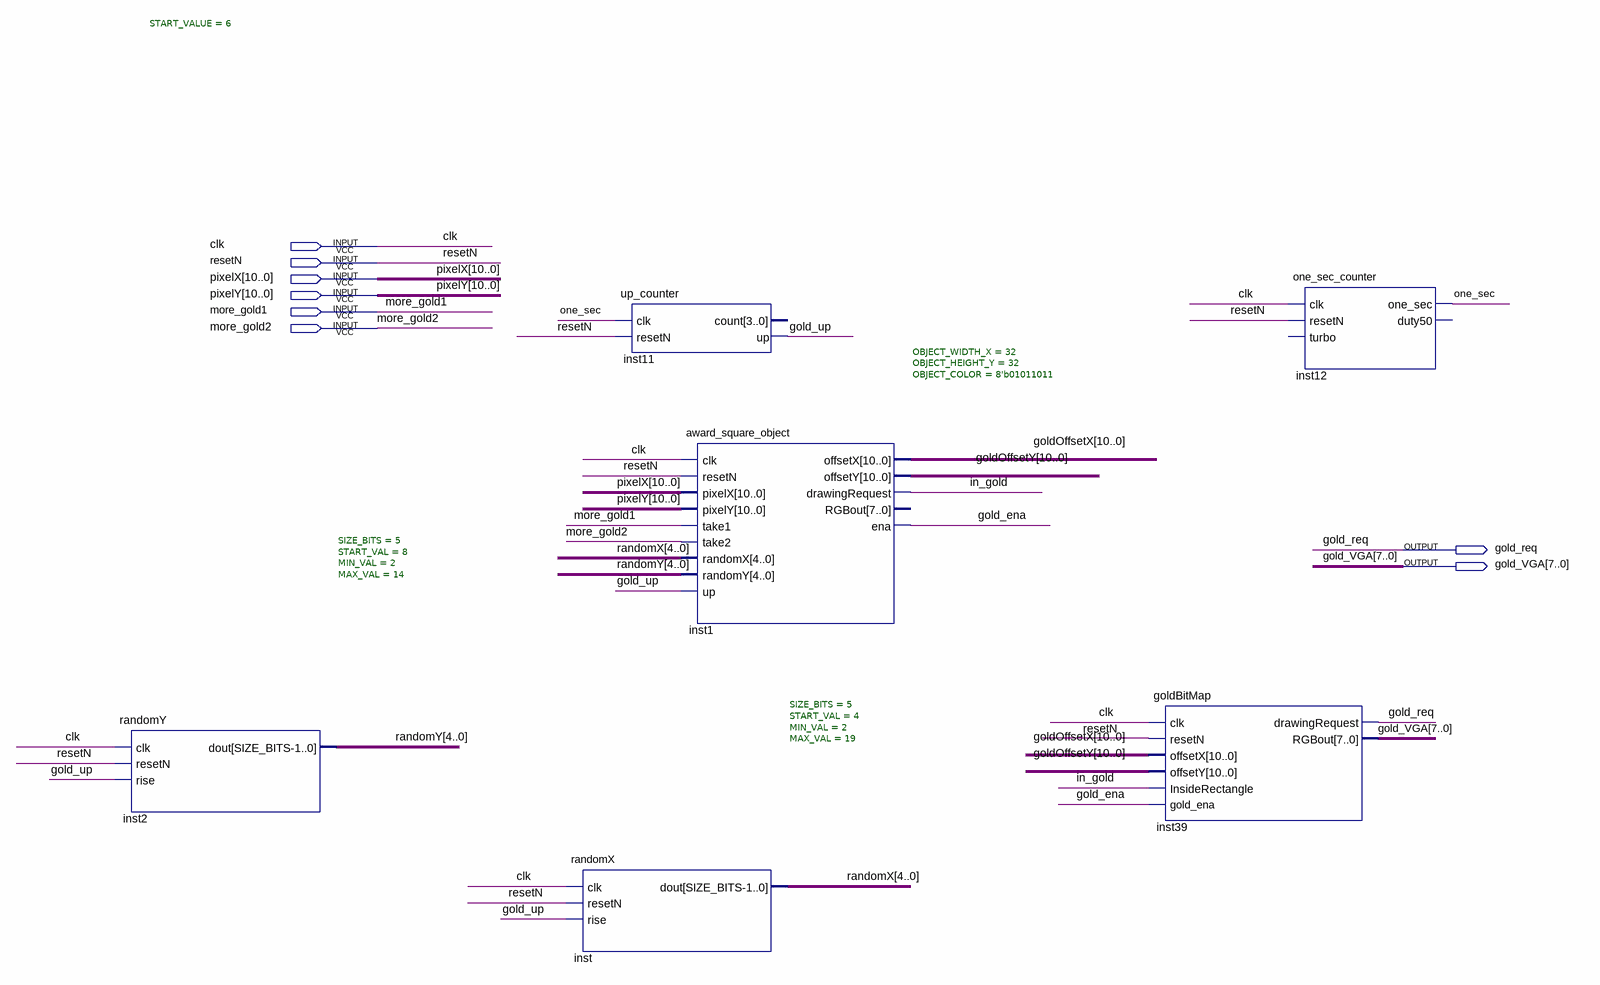
[diagram p0: schematic sheet]
// Quartus schematic gold.bdf as structural Verilog: 6 symbols, 8 pins
module gold (
  input  clk,
  input  resetN,
  input  [10:0] pixelX,
  input  [10:0] pixelY,
  input  more_gold1,
  input  more_gold2,
  output gold_req,
  output [7:0] gold_VGA
);

  wire gold_ena, gold_up, in_gold, one_sec;
  wire [4:0] randomX, randomY;
  wire [10:0] goldOffsetX, goldOffsetY;

  randomY #(.SIZE_BITS(5), .START_VAL(8), .MIN_VAL(2), .MAX_VAL(14)) inst2 (
    .clk(clk), .resetN(resetN), .rise(gold_up), .dout(randomY));
  randomX #(.SIZE_BITS(5), .START_VAL(4), .MIN_VAL(2), .MAX_VAL(19)) inst (
    .clk(clk), .resetN(resetN), .rise(gold_up), .dout(randomX));
  up_counter #(.START_VALUE(6)) inst11 (.clk(one_sec), .resetN(resetN), .up(gold_up));  // open: count
  award_square_object #(.OBJECT_WIDTH_X(32), .OBJECT_HEIGHT_Y(32), .OBJECT_COLOR(8'b01011011)) inst1 (
    .clk(clk), .resetN(resetN), .pixelX(pixelX), .pixelY(pixelY), .take1(more_gold1), .take2(more_gold2),
    .randomX(randomX), .randomY(randomY), .up(gold_up), .offsetX(goldOffsetX), .offsetY(goldOffsetY),
    .drawingRequest(in_gold), .ena(gold_ena));  // open: RGBout
  goldBitMap inst39 (
    .clk(clk), .resetN(resetN), .offsetX(goldOffsetX), .offsetY(goldOffsetY), .InsideRectangle(in_gold),
    .gold_ena(gold_ena), .drawingRequest(gold_req), .RGBout(gold_VGA));
  one_sec_counter inst12 (.clk(clk), .resetN(resetN), .one_sec(one_sec));  // open: turbo, duty50
endmodule
